# Altium project OLED_PCB_Project.PrjPCB
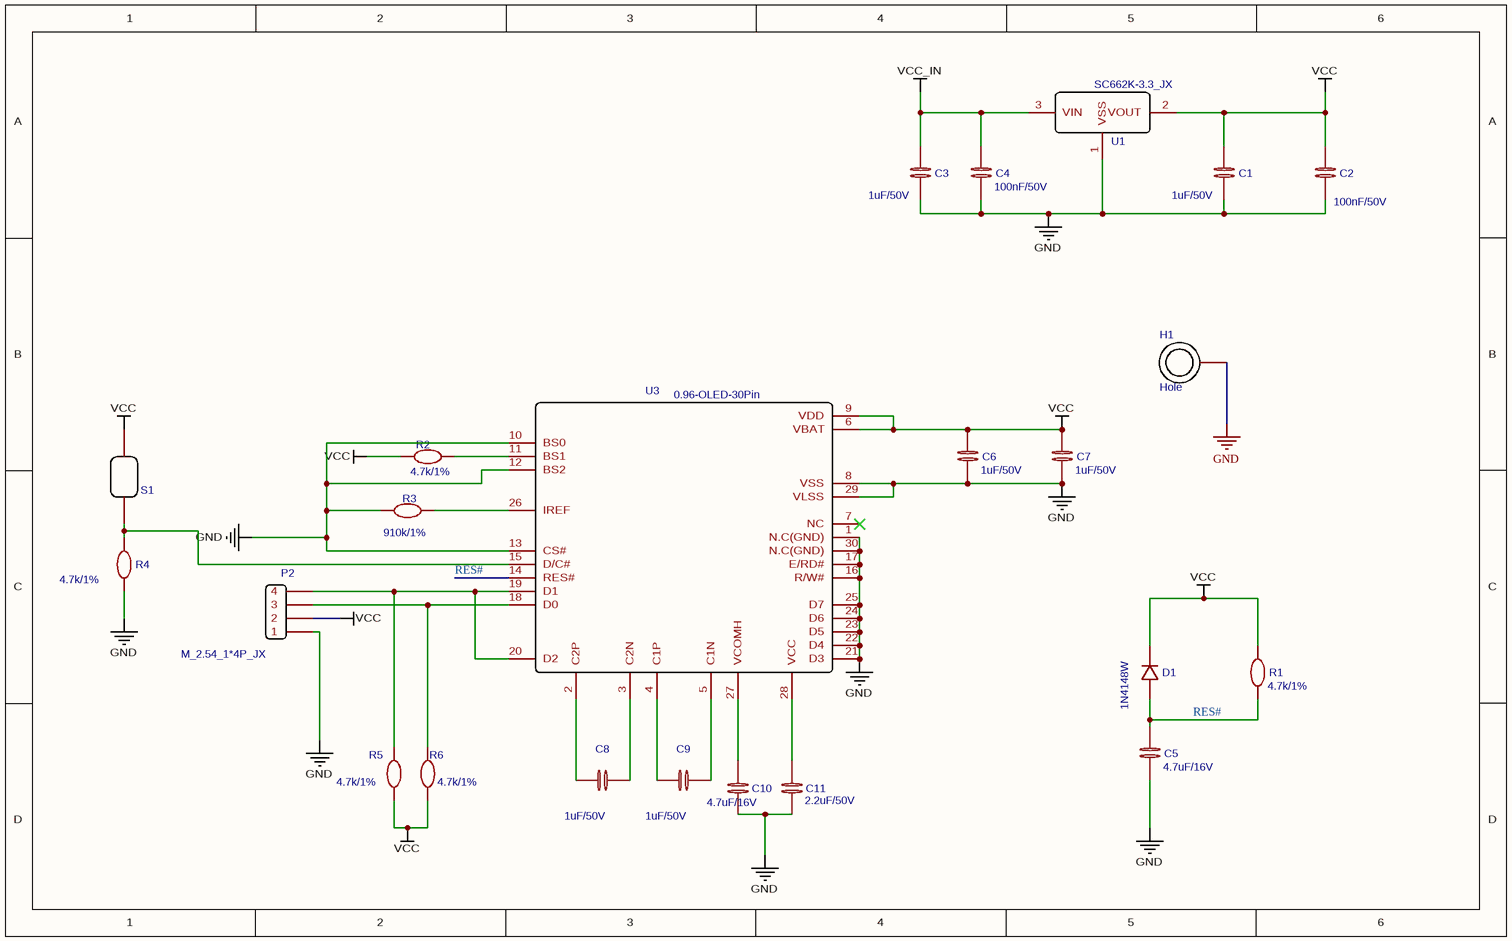
[diagram p0: OLED_PCB_Project.schdoc]
1 sheet, 23 parts. Net scope: global (net labels, ports and power ports of the same name join across sheets).
Board file: OLED_PCB_Project.pcbdoc

## Sheet OLED_PCB_Project.schdoc
size 282 x 175 mm

### Parts
C1  1uF/50V  [0603_C_JX]
C2  100nF/50V  [0603_C_JX]
C3  1uF/50V  [0603_C_JX]
C4  100nF/50V  [0603_C_JX]
C5  4.7uF/16V  [0603_C_JX]
C6  1uF/50V  [0603_C_JX]
C7  1uF/50V  [0603_C_JX]
C8  1uF/50V  [0603_C_JX]
C9  1uF/50V  [0603_C_JX]
C10  4.7uF/16V  [0603_C_JX]
C11  2.2uF/50V  [0603_C_JX]
D1  1N4148W  [SOD-523_JX]
H1  Hole  [PCBComponent_1 - duplicate]
P2  M_2.54_1*4P_JX  [M_2.54_1*4P_JX]
R1  4.7k/1%  [0603_R_JX]
R2  4.7k/1%  [0603_R_JX]
R3  910k/1%  [0603_R_JX]
R4  4.7k/1%  [0603_R_JX]
R5  4.7k/1%  [0603_R_JX]
R6  4.7k/1%  [0603_R_JX]
U1  SC662K-3.3_JX  [sc662k]
U3  0.96-OLED-30Pin  [new_OLED30P]
U4  S1  [S1]

### Nets
GND: C1.2 C2.2 C3.2 C4.2 C5.2 C6.2 C7.2 C10.1 C11.1 H1.1 P2.1 R3.1 R4.1 U1.1(VSS) U3.1(N.C(GND)) U3.8(VSS) U3.10(BS0) U3.12(BS2) U3.13(CS#) U3.16(R/W#) U3.17(E/RD#) U3.21(D3) U3.22(D4) U3.23(D5) U3.24(D6) U3.25(D7) U3.29(VLSS) U3.30(N.C(GND))
VCC: C1.1 C2.1 C6.1 C7.1 D1.1(K) P2.2 R1.2 R2.1 R5.1 R6.1 U1.2(VOUT) U3.6(VBAT) U3.9(VDD) U4.1
VCC_IN: C3.1 C4.1 U1.3(VIN)
RES#: C5.1 D1.2(A) R1.1 U3.14(RES#)
NetC8_1: C8.1 U3.2(C2P)
NetC8_2: C8.2 U3.3(C2N)
NetC9_1: C9.1 U3.4(C1P)
NetC9_2: C9.2 U3.5(C1N)
NetC10_2: C10.2 U3.27(VCOMH)
NetC11_2: C11.2 U3.28(VCC)
NetP2_3: P2.3 R6.2 U3.18(D0)
NetP2_4: P2.4 R5.2 U3.19(D1) U3.20(D2)
NetR2_2: R2.2 U3.11(BS1)
NetR3_2: R3.2 U3.26(IREF)
NetR4_2: R4.2 U3.15(D/C#) U4.2

Not connected (* = marked no-connect by the designer): U3 7(NC)*

### Library data of the parts
C1 C3 C6-C9 = 1uF/50V: nameAlias: Value(F); spicePre: C; spiceSymbolName: Cap_RAD-0.1_EU
C2 C4 = 100nF/50V: nameAlias: Value(F); spicePre: C; spiceSymbolName: Cap_RAD-0.1_EU
C5 C10 = 4.7uF/16V: nameAlias: Value(F); spicePre: C; spiceSymbolName: Cap_RAD-0.1_EU
C11 = 2.2uF/50V: nameAlias: Value(F); spicePre: C; spiceSymbolName: Cap_RAD-0.1_EU
D1 = 1N4148W: BOM_Manufacturer: SEMTECH; SMT Type: Basic; BOM_Supplier: LCSC; BOM_Manufacturer Part: 1N4148W; image: //image.lceda.cn/szlcsc/C81598.jpg; BOM_Supplier Part: C81598; BOM_LCSC Assembly: Yes; spicePre: D
H1 = Hole: Contributor: lc_ms; spicePre: H; spiceSymbolName: Hole
P2 = M_2.54_1*4P_JX: Contributor: jixin-team; BOM_Supplier Part: C115245; BOM_Supplier: LCSC; spicePre: P
R1 R2 R4-R6 = 4.7k/1%: nameAlias: Value(Ω); spicePre: R; spiceSymbolName: Res_AXIAL-0.3(1/8W)_EU
R3 = 910k/1%: nameAlias: Value(Ω); spicePre: R; spiceSymbolName: Res_AXIAL-0.3(1/8W)_EU
U1 = SC662K-3.3_JX: Contributor: jixin002; BOM_Manufacturer Part: SC662K-3.3; spicePre: U
U3 = 0.96-OLED-30Pin_JX-周利杰: Contributor: 2019电子技术新讲座; spicePre: U
U4 = S1: Contributor: ywl21; spicePre: U